# EasyEDA Pro project ProPrj_Tailtip_2026-06-10.epro, board PCB1
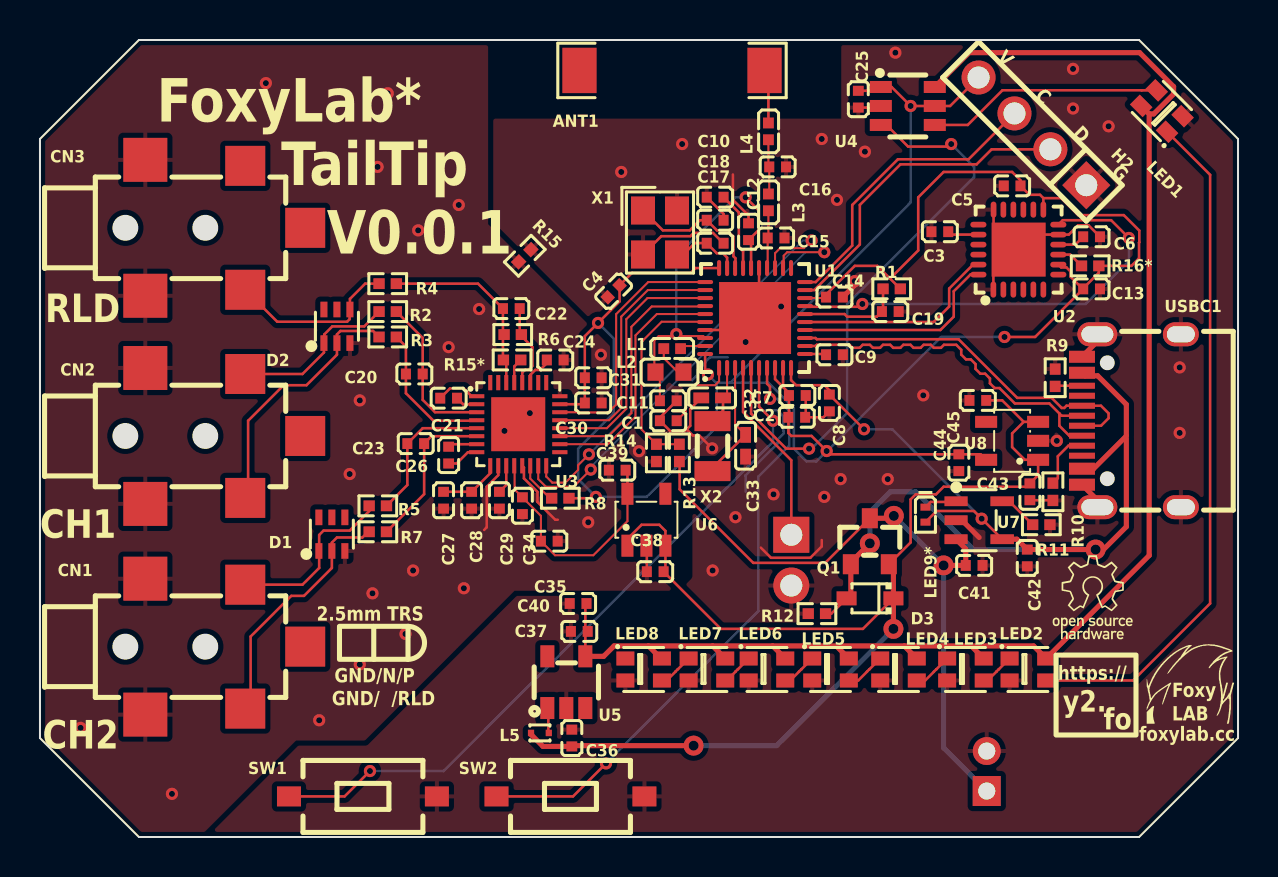
[diagram p1: board, top side]
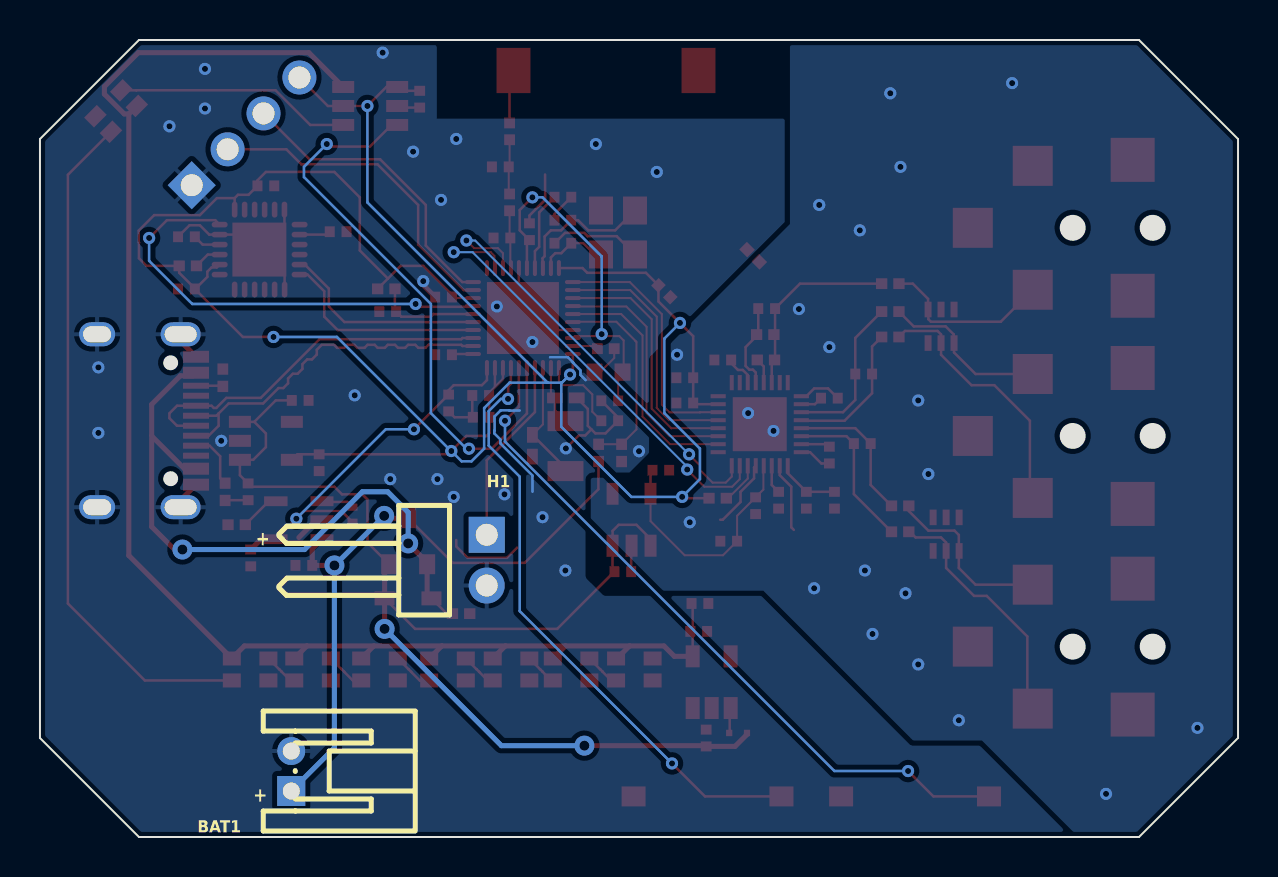
[diagram p2: board, bottom side, seen from below]

Outline 59.94 x 39.88 mm; copper layers: Top Layer, Bottom Layer. Coordinates in mm from the lower left corner of the outline.
Outline path: 0,34.92 0,4.95 4.95,0 54.99,0 59.94,4.95 59.94,34.92 54.99,39.88 4.95,39.88 0,34.92
Stack: Top Layer 0.035mm / Dielectric1 1.51mm FR4 er 4.5 / Bottom Layer 0.035mm

## Design rules (mm)
net NRF_DN: NRF_USB
net NRF_DP: NRF_USB
template: 自定义配置
spacing copperThickness1oz (default): track to track 0.102, other pairs 0.152 to 0.3
spacing copperThickness2oz: track to track 0.203, other pairs 0.152 to 0.3
spacing copperThicknessInner0.5oz: track to track 0.089, other pairs 0.152 to 0.3
track width copperThickness1oz (default): min 0.102, default 0.254, max 2.54
track width copperThickness2oz: min 0.203, default 0.254, max 2.54
track width copperThickness0.5oz: min 0.089, default 0.254, max 2.54
differential pair differentialPair (default): width min 0.127, default 0.254, max 2.54; gap min 0.152, default 0.152
via viaSize (default): diameter min 0.3, default 0.61, max 10; hole min 0.2, default 0.305, max 6.3

## Placement (name value [footprint] x y rotation side)
ANT1  AN9520-245  [ANT-SMD_L9.5-W2.1]  31.62 38.35 180 top
BAT1  S2B-PH-K-S(LF)(SN)  [CONN-TH_S2B-PH-K-S-LF-SN]  47.37 3.3 270 bottom
C1  100nF  [C0402#2]  31.44 20.83 0 top
C2  100nF  [C0402#2]  37.87 21 180 top
C3  2.2nF  [C0402#2]  45.03 30.28 180 top
C4  100nF  [C0402#2]  28.7 27.3 45 top
C5  100nF  [C0402#2]  48.64 32.58 180 top
C6  100nF  [C0402#2]  52.62 30.03 0 top
C7  4.7uF  [C0402#2]  37.89 22.09 180 top
C8  4.7uF  [C0402#2]  39.5 21.72 90 top
C9  4.7uF  [C0402#2]  39.75 24.13 180 top
C10  100pF  [C0402#2]  33.78 32.01 0 top
C11  1uF  [C0402#2]  31.44 21.83 180 top
C12  47nF  [C0402#2]  35.45 30.28 270 top
C13  100nF  [C0402#2]  52.62 27.42 0 top
C14  100nF  [C0402#2]  39.75 27.01 180 top
C15  1pF  [C0402#2]  36.83 29.97 180 top
C16  1.2pF  [C0402#2]  36.91 33.53 180 top
C17  15pF  [C0402#2]  33.78 29.71 0 top
C18  15pF  [C0402#2]  33.78 30.86 0 top
C19  100nF  [C0402#2]  42.54 26.29 180 top
C20  2.2nF  [C0402#2]  18.73 23.17 0 top
C21  1nF  [C0402#2]  20.45 21.96 0 top
C22  1.5nF  [C0402#2]  23.58 26.44 0 top
C23  2.2nF  [C0402#2]  18.8 19.68 180 top
C24  1uF  [C0402#2]  25.78 23.87 180 top
C25  100nF  [C0402#2]  40.95 36.91 90 top
C26  1nF  [C0402#2]  20.45 19.11 270 top
C27  100nF  [C0402#2]  20.19 16.85 270 top
C28  10uF  [C0402#2]  21.6 16.85 90 top
C29  1uF  [C0402#2]  22.99 16.85 270 top
C30  100nF  [C0402#2]  27.68 21.72 0 top
C31  1uF  [C0402#2]  27.68 22.98 0 top
C32  18pF  [C0402]  33.63 21.97 0 top
C33  18pF  [C0402]  35.31 19.58 90 top
C34  100nF  [C0402#2]  24.14 16.58 270 top
C35  1uF  [C0402#2]  25.48 14.8 0 top
C36  4.7uF  [C0402#2]  26.61 4.95 90 top
C37  2.2uF  [C0402#2]  26.99 10.29 0 top
C38  100nF  [C0402#2]  30.78 13.28 0 top
C39  100nF  [C0402#2]  28.88 18.35 0 top
C40  100nF  [C0402#2]  26.92 11.68 180 top
C41  4.7uF  [C0402#2]  46.74 13.59 0 top
C42  4.7uF  [C0402#2]  49.4 13.96 90 top
C43  100nF  [C0402#2]  49.53 17.27 90 top
C44  100nF  [C0402#2]  46.93 21.84 0 top
C45  100nF  [C0402#2]  45.97 18.73 90 top
CN1  PJ-209X-3B-SMT  [AUDIO-SMD_PJ-209X-3B-SMT]  9.27 9.52 0 top
CN2  PJ-209X-3B-SMT  [AUDIO-SMD_PJ-209X-3B-SMT]  9.27 20.07 0 top
CN3  PJ-209X-3B-SMT  [AUDIO-SMD_PJ-209X-3B-SMT]  9.27 30.48 0 top
D1  TPD4E1B06DCKR  [SC-70-6_L2.2-W1.3-P0.65-LS2.1-BL]  14.6 15.15 0 top
D2  TPD4E1B06DCKR  [SC-70-6_L2.2-W1.3-P0.65-LS2.1-BL]  14.86 25.55 0 top
D3  1N5819WS  [SOD-323_L1.8-W1.3-LS2.5-RD]  41.53 11.94 180 top
H1  PZ254R-11-02P  [HDR-TH_2P-P2.54-H-M-W10.4]  37.59 13.85 270 bottom
H2  PZ254V-11-04P  [HDR-TH_4P-P2.54-V-M]  49.66 35.31 135 top
L1  15nH  [L0402]  31.63 24.43 180 top
L2  10uH  [L0603]  31.5 23.26 180 top
L3  4.7nH  [L0402]  36.45 31.75 90 top
L4  2.2nH  [L0402]  36.45 35.31 90 top
L5  2.2uH  [IND-SMD_L1.0-W0.6_PLEA67BCA4R7M-1PT00]  25.01 5.21 0 top
LED1  WS2812B-2020  [LED-SMD_4P-L2.0-W2.0-TL_WS2812B-2020]  56.13 36.32 135 top
LED2  WS2812B-2020  [LED-SMD_4P-L2.0-W2.0-TL_WS2812B-2020]  49.43 8.38 0 top
LED3  WS2812B-2020  [LED-SMD_4P-L2.0-W2.0-TL_WS2812B-2020]  46.31 8.38 0 top
LED4  WS2812B-2020  [LED-SMD_4P-L2.0-W2.0-TL_WS2812B-2020]  42.96 8.38 0 top
LED5  WS2812B-2020  [LED-SMD_4P-L2.0-W2.0-TL_WS2812B-2020]  39.55 8.38 0 top
LED6  WS2812B-2020  [LED-SMD_4P-L2.0-W2.0-TL_WS2812B-2020]  36.38 8.38 0 top
LED7  WS2812B-2020  [LED-SMD_4P-L2.0-W2.0-TL_WS2812B-2020]  33.37 8.38 0 top
LED8  WS2812B-2020  [LED-SMD_4P-L2.0-W2.0-TL_WS2812B-2020]  30.21 8.38 0 top
LED9*  NCD0402G1  [LED-SMD_L1.0-W0.5_FC-F1005UGK]  44.31 16.13 270 top
Q1  AO3401A  [SOT-23_L2.9-W1.3-P1.90-LS2.4-BR]  41.52 14.8 270 top
R1  10kΩ  [R0402]  42.62 27.43 180 top
R2  47kΩ  [R0402]  17.4 26.29 0 top
R3  47kΩ  [R0402]  17.4 25.02 0 top
R4  100kΩ  [R0402]  17.4 27.69 0 top
R5  47kΩ  [R0402]  16.91 16.57 0 top
R6  1MΩ  [R0402]  23.65 25.14 0 top
R7  47kΩ  [R0402]  16.91 15.27 0 top
R8  4.7kΩ  [R0402]  26.03 16.95 180 top
R9  5.1kΩ  [R0402]  50.79 22.98 90 top
R10  5.1kΩ  [R0402]  50.68 17.27 270 top
R11  10kΩ  [R0402]  50.1 15.63 0 top
R12  100kΩ  [R0402]  38.87 11.18 180 top
R13  200kΩ  [R0402]  31.99 19.22 270 top
R14  300kΩ  [R0402]  30.84 19.22 90 top
R15  0Ω  [R0402]  24.26 29.08 225 top
R15*  100kΩ  [R0402]  23.62 23.87 0 top
R16*  10kΩ  [R0402]  52.55 28.58 0 top
SW1  TS-1101-C-W  [SW-SMD_L6.0-W3.3-LS8.0_TS-1101-C-W]  16.16 2.03 0 top
SW2  TS-1101-C-W  [SW-SMD_L6.0-W3.3-LS8.0_TS-1101-C-W]  26.54 2.03 0 top
U1  nRF52833-QDAA-R  [QFN-40_L5.0-W5.0-P0.40-TL-EP3.6]  35.78 25.97 90 top
U2  MPU-6050  [QFN-24_L4.0-W4.0-P0.50-BL-EP2.7]  48.95 29.39 0 top
U3  ADS1292IRSMR  [QFN-32_L4.0-W4.0-P0.40-TL-EP2.7]  23.93 20.65 0 top
U4  SN74LVC1T45DBVR  [SOT-23-6_L2.9-W1.6-P0.95-LS2.8-BR]  43.42 36.58 180 top
U5  TPS613222ADBVR  [TSOT-23-5_L2.9-W1.6-P0.95-LS2.8-BR]  26.34 7.75 270 top
U6  TLV70233DBVR  [SOT-23-5_L3.0-W1.7-P0.95-LS2.8-BR]  30.34 15.87 270 top
U7  MCP73831T-2ACI/OT  [SOT-23-5_L3.0-W1.7-P0.95-LS2.8-BL]  46.99 15.85 270 top
U8  TLV70233DBVR  [SOT-23-5_L3.0-W1.7-P0.95-LS2.8-BR]  48.64 19.82 0 top
USBC1  TYPE-C-31-M-12  [USB-C_SMD-TYPE-C-31-M-12_1]  54.61 20.83 90 top
X1  32MHz  [CRYSTAL-SMD_4P-L3.2-W2.5-BL]  31.02 30.25 270 top
X2  32.768kHz  [FC-135R_L3.2-W1.5]  33.65 19.56 270 top

## Footprints (pads in the part's own frame, mm; a bottom-side part is the same pattern mirrored in y, then rotated)
ANT-SMD_L9.5-W2.1
  rect 1.71x2.268 smd: 1(-4.63,0) 2(4.63,0)
AUDIO-SMD_PJ-209X-3B-SMT
  rect 2.2x2.2 smd: 1(-4,3.4) 1(-4,-3.4)
  rect 2x2 smd: 2(1,-3.1) 3(1,3.1) 10(4,0)
C0402
  rect 0.79x0.54 smd: 1(-0.545,0) 2(0.545,0)
C0402#2
  rect 0.5x0.54 smd: 1(-0.42,0) 2(0.42,0)
CONN-TH_S2B-PH-K-S-LF-SN
  rect 1.5x1.4 hole 0.85: 1(1,0)
  round 1.4 hole 0.85: 2(-1,0)
CRYSTAL-SMD_4P-L3.2-W2.5-BL
  rect 1.4x1.2 smd: 1(-1.1,-0.85) 2(1.1,-0.85) 3(1.1,0.85) 4(-1.1,0.85)
FC-135R_L3.2-W1.5
  rect 1x1.8 smd: 1(-1.25,0) 2(1.25,0)
HDR-TH_2P-P2.54-H-M-W10.4
  rect 1.8x1.8 hole 1.1: 1(-1.27,0)
  round 1.8 hole 1.1: 2(1.27,0)
HDR-TH_4P-P2.54-V-M
  rect 1.7x1.7 hole 1.1: 1(-3.81,0)
  round 1.7 hole 1.1: 2(-1.27,0) 3(1.27,0) 4(3.81,0)
IND-SMD_L1.0-W0.6_PLEA67BCA4R7M-1PT00
  rect 0.31x0.32 smd: 1(-0.445,0) 2(0.445,0)
L0402
  rect 0.54x0.54 smd: 1(-0.42,0) 2(0.42,0)
L0603
  rect 0.8x0.864 smd: 1(-0.7,0) 2(0.7,0)
LED-SMD_4P-L2.0-W2.0-TL_WS2812B-2020
  rect 0.9x0.7 smd: 1(-0.915,0.55) 2(-0.915,-0.55) 3(0.915,-0.55) 4(0.915,0.55)
LED-SMD_L1.0-W0.5_FC-F1005UGK
  rect 0.35x0.5 smd: 1(-0.375,0) 2(0.375,0)
QFN-24_L4.0-W4.0-P0.50-BL-EP2.7
  oval 0.28x0.8 smd: 1(-1.25,-2) 2(-0.75,-2) 3(-0.25,-2) 4(0.25,-2) 5(0.75,-2) 6(1.25,-2) 13(1.25,2) 14(0.75,2) 15(0.25,2) 16(-0.25,2) 17(-0.75,2) 18(-1.242,2)
  oval 0.8x0.28 smd: 7(2,-1.25) 8(2,-0.75) 9(2,-0.25) 10(2,0.25) 11(2,0.75) 12(2,1.25) 19(-2,1.25) 20(-2,0.75) 21(-2,0.25) 22(-2,-0.25) 23(-2,-0.75) 24(-2,-1.25)
  rect 2.7x2.7 smd: 25(0.013,0)
QFN-32_L4.0-W4.0-P0.40-TL-EP2.7
  rect 0.76x0.2 smd: 1(-2.08,1.4) 2(-2.08,1) 3(-2.08,0.6) 4(-2.08,0.2) 5(-2.08,-0.2) 6(-2.08,-0.6) 7(-2.08,-1) 8(-2.08,-1.4) 17(2.08,-1.4) 18(2.08,-1) 19(2.08,-0.6) 20(2.08,-0.2) 21(2.08,0.2) 22(2.08,0.6) 23(2.08,1) 24(2.08,1.4)
  rect 0.2x0.76 smd: 9(-1.4,-2.08) 10(-1,-2.08) 11(-0.6,-2.08) 12(-0.2,-2.08) 13(0.2,-2.08) 14(0.6,-2.08) 15(1,-2.08) 16(1.4,-2.08) 25(1.4,2.08) 26(1,2.08) 27(0.6,2.08) 28(0.2,2.08) 29(-0.2,2.08) 30(-0.6,2.08) 31(-1,2.08) 32(-1.4,2.08)
  rect 2.7x2.7 smd: 33(0,0)
QFN-40_L5.0-W5.0-P0.40-TL-EP3.6
  oval 0.8x0.2 smd: 1(-2.499,1.8) 2(-2.499,1.4) 3(-2.499,1) 4(-2.499,0.6) 5(-2.499,0.2) 6(-2.499,-0.2) 7(-2.499,-0.6) 8(-2.499,-1) 9(-2.499,-1.4) 10(-2.499,-1.8) 21(2.499,-1.8) 22(2.499,-1.4) 23(2.499,-1) 24(2.499,-0.6) 25(2.499,-0.2) 26(2.499,0.2) 27(2.499,0.6) 28(2.499,1) 29(2.499,1.4) 30(2.499,1.8)
  oval 0.2x0.8 smd: 11(-1.8,-2.499) 12(-1.4,-2.499) 13(-1,-2.499) 14(-0.6,-2.499) 15(-0.2,-2.499) 16(0.2,-2.499) 17(0.6,-2.499) 18(1,-2.499) 19(1.4,-2.499) 20(1.8,-2.499) 31(1.8,2.499) 32(1.4,2.499) 33(1,2.499) 34(0.6,2.499) 35(0.2,2.499) 36(-0.2,2.499) 37(-0.6,2.499) 38(-1,2.499) 39(-1.4,2.499) 40(-1.8,2.499)
  rect 3.6x3.6 smd: 41(0,0)
R0402
  rect 0.566x0.54 smd: 1(-0.433,0) 2(0.433,0)
SC-70-6_L2.2-W1.3-P0.65-LS2.1-BL
  rect 0.35x0.78 smd: 1(-0.65,-0.84) 2(0,-0.84) 3(0.65,-0.84) 4(0.65,0.84) 5(0,0.84) 6(-0.65,0.84)
SOD-323_L1.8-W1.3-LS2.5-RD
  rect 1x0.7 smd: 1(-1.173,0) 2(1.173,0)
SOT-23-5_L3.0-W1.7-P0.95-LS2.8-BL
  rect 0.49x1.157 smd: 1(-0.95,-1.153) 2(0,-1.153) 3(0.95,-1.153)
  rect 0.49x1.175 smd: 4(0.95,1.153) 5(-0.95,1.153)
SOT-23-5_L3.0-W1.7-P0.95-LS2.8-BR
  rect 1.1x0.6 smd: 1(1.3,-0.95) 2(1.3,0) 3(1.3,0.95) 4(-1.3,0.95) 5(-1.3,-0.95)
SOT-23-6_L2.9-W1.6-P0.95-LS2.8-BR
  rect 1.1x0.6 smd: 1(1.35,-0.95) 2(1.35,0) 3(1.35,0.95) 4(-1.35,0.95) 5(-1.35,0) 6(-1.35,-0.95)
SOT-23_L2.9-W1.3-P1.90-LS2.4-BR
  rect 1x0.8 smd: 1(1.15,-0.95) 2(1.15,0.95) 3(-1.15,0)
SW-SMD_L6.0-W3.3-LS8.0_TS-1101-C-W
  rect 1.2x1 smd: 1(-3.7,0) 2(3.7,0)
TSOT-23-5_L2.9-W1.6-P0.95-LS2.8-BR
  rect 1.1x0.7 smd: 1(1.294,-0.951) 2(1.294,-0.001) 3(1.294,0.951) 4(-1.294,0.951) 5(-1.294,-0.949)
USB-C_SMD-TYPE-C-31-M-12_1
  oval 1.2x2 hole 0.8x1.6: 1(4.325,1.706) 4(-4.325,1.706)
  oval 1.2x1.8 hole 0.8x1.4: 2(4.325,-2.474) 3(-4.325,-2.474)
  custom 0.6x1.3 smd: A1B12(-3.2,2.474) A4B9(-2.4,2.474) B1A12(3.2,2.474) B4A9(2.401,2.474)
  rect 0.3x1.3 smd: A5(-1.25,2.474) A6(-0.25,2.474) A7(0.25,2.474) A8(1.25,2.474) B5(1.75,2.474) B6(0.75,2.474) B7(-0.75,2.474) B8(-1.75,2.474)

## Nets
As in the schematic, except:
3V3: C2.2 C4.2 C5.1 C7.2 C13.1 C14.2 C25.2 C30.1 C31.1 C45.2 H2.4 R1.1 R8.1 R16*.2 U1.8 U1.9 U1.18 U1.30 U1.40 U2.8 U2.13 U3.23 U4.1 U4.5 U8.5
VBUS: C8.2 C42.2 D3.2 LED9*.2 Q1.1 R12.1 U1.10 U7.4 USBC1.A4B9 USBC1.B4A9
$1N2506: LED9*.1 U7.1
$1N5837: R16*.1 U2.9
$1N8365: R15*.2 U3.29
$1N8369: C22.1 R4.2 R6.1 R15*.1 U3.30

Pads without a net: ANT1 2; CN1 10; CN2 10; CN3 3 10; D1 4 5 6; D2 5 6; LED8 1; U1 21; U2 2 3 4 5 6 7 14 15 16 17 19 21 22; U3 17 25 26 31 32; U5 3 5; U6 4; U8 4; USBC1 A8 B8

## Via types
v1: diameter 1, hole 0.5, Top Layer to Bottom Layer, 6 vias
v2: diameter 0.61, hole 0.305, Top Layer to Bottom Layer, 67 vias

## Routing (per net, layer and track width the routed paths; a pad name or vN(x,y) marks a point on that pad's centre or on a via; arc(x,y) is an arc through that point)
3V3: length 131.5
  Top Layer w0.102: 39.33,26.97 U1.18
  Top Layer w0.127: U1.30 32.8,28.47 32.56,28.23 29.63,28.23 29,27.6 29,26.8 v2(27.92,25.72) 27.26,25.06 27.26,21.72 27.2,21.65 U3.23 ; C13.1 49.79,25.02 v2(48.26,25.02) ; 50.2,31.97 51.09,31.97 51.94,31.11 54.23,31.11 55,30.34 55,29.76 54.99,29.74 54.99,28.96 54.61,28.58 R16*.2 52.98,28.23 52.17,27.42 51.57,28.02 51.57,28.29 51.36,28.5 51.1,28.5 U2.8 ; 50.2,31.97 U2.13 ; 50.2,31.97 50.04,32.13 49.51,32.13 C5.1 49.06,32.85 48.64,33.27 45.21,33.27 43.94,32 43.94,29.35 42.53,27.94 ; 37.18,22.51 36.78,22.91 U1.8 ; 37.18,22.51 37.47,22.22 C7.2 37.47,21.03 C2.2 37.45,20.21 37.59,20.07 38.61,20.07 39.53,19.15 C45.2 47.06,19.15 U8.5 ; 37.18,22.51 U1.9 ; U1.40 33.28,23.28 v2(33.42,23.14) ; R8.1 27.75,16.95 v2(27.81,17.02) ; C25.2 41.88,37.34 U4.1 42.61,37.53 v2(43.56,36.58) U4.5 45.54,36.58 46.96,38 ; 42.53,27.94 R1.1 ; 42.53,27.94 41.9,28.57 40.77,28.57 39.33,27.14 C14.2
  Bottom Layer w0.127: 34.54,22.73 36.45,22.73 37.72,21.46 37.72,19.43 38.35,18.8 38.84,18.8 v2(39.36,19.31) ; 34.54,22.73 43.56,31.75 v2(43.56,36.58) ; 34.54,22.73 33.86,22.73 ; v2(33.42,23.14) 33.83,22.73 33.86,22.73 ; 33.86,22.73 33.86,20.53 30.35,17.02 v2(27.81,17.02) 26.92,17.91 26.92,19.43 28.7,21.21 28.7,24.94 v2(27.92,25.72) ; 39.37,19.3 45.09,25.02 v2(48.26,25.02)
3V3A: length 12.2
  Top Layer w0.102: U6.5 29.39,15.8 27.69,14.1 25.77,14.1 C35.1 25.06,16.07 C34.1 23.75,17.39 23.75,18.56 23.73,18.57
  Top Layer w0.127: C39.2 29.39,18.26 U6.5
5V0: length 76.9
  Top Layer w0.127: U5.4 27.29,11.63 C40.1
  Top Layer w0.254: LED7.4 33.66,9.56 ; 33.66,9.56 30.44,9.56 ; 33.66,9.56 36.66,9.56 ; 46.59,9.56 49.72,9.56 LED2.4 55.5,14.09 55.5,36.18 ; 46.59,9.56 LED3.4 ; 46.59,9.56 43.24,9.56 ; 30.44,9.56 31.07,8.93 LED8.4 ; 30.44,9.56 28.72,9.56 28.2,9.04 U5.4 ; 43.24,9.56 39.84,9.56 ; 43.24,9.56 43.87,8.93 ; 39.84,9.56 40.47,8.93 ; 39.84,9.56 36.66,9.56 ; 55.5,36.18 55.73,36.18 56.72,37.17 56.72,37.54 55.02,39.24 46.49,39.24 U4.6 ; 55.5,36.18 LED1.4 ; 36.66,9.56 LED6.4
AGND: length 8.3
  Top Layer w0.127: U6.2 30.36,14.56 C38.1 ; U3.10 22.93,18.1 22.35,17.53 22.35,15.49 22.22,15.37 ; U3.13 24.22,18.49 24.22,17.94 24.89,17.27 24.89,16.76 25.78,15.87 25.91,15.87
  vias: v2(2.03,5.46) v2(6.6,2.16) v2(11.3,37.72) v2(13.97,5.84) v2(15.49,18.16) v2(16,21.84) v2(16,8.64) v2(16.64,12.19) v2(16.89,33.53) v2(17.4,37.21) v2(18.29,10.16) v2(18.67,13.33) v2(18.92,30.35) v2(20.45,24.51) v2(20.96,31.62) v2(21.21,12.45) v2(21.97,26.42) v2(23.24,20.32) v2(24.51,21.21) v2(27.43,15.75) v2(28.07,24.13)
GND: length 53.4
  Top Layer w0.127: C8.1 39.2,21 38.29,21 38.31,21.03 38.31,22.09 ; C43.1 50.67,16.85 R10.2 ; X1.2 31.09,30.06 32.54,30.06 32.71,30.23 33.67,30.23 34.19,29.71 C17.2 ; 32.35,20.39 32.53,20.57 32.53,21.42 C32.1 ; 32.35,20.39 32.15,20.19 31.65,20.19 C1.1 31.02,20.99 C11.1 ; 32.35,20.39 32.37,20.39 32.66,20.09 32.98,20.09 v2(33.63,19.44) ; C6.2 52.46,30.61 51.94,30.61 51.48,30.14 U2.11 50.03,30.14 50.03,29.52 49.9,29.39 U2.25 ; U2.25 47.71,30.64 U2.18 ; U2.25 47.7,28.13 U2.1 ; 36.07,14.48 36.58,13.97 38.54,13.97 39.12,14.54 39.12,14.86 ; U1.25 35.98,26.17 U1.41 35.18,25.37 U1.37 ; U4.2 41.99,36.49 C25.1 ; C10.1 34.2,31.17 C18.2 ; 34.67,33.15 34.67,31.88 35.45,31.1 C12.1
  Top Layer w0.254: U7.2 46.13,15.85 46.99,14.99 ; v2(40.77,27.81) 40.77,27.61 C14.1 ; USBC1.A1B12 52.9,16.86 USBC1.4 ; USBC1.B1A12 52.9,24.8 USBC1.1
  Bottom Layer w0.127: 35.31,17.27 35.31,18.09 36.91,19.69 36.91,19.89 37.21,20.19 37.21,20.32 37.2,20.33 37.2,21.04 36.89,21.35 36.46,21.35 36.45,21.34 35.94,21.34 ; 32.64,22.86 32.9,23.12 32.9,23.35 33.27,23.73 33.27,23.75 33.53,24 34.42,24
  vias: v2(29.08,33.27) v2(29.97,19.3) v2(32.13,34.67) v2(33.66,13.33) v2(34.8,16) v2(35.31,24.76) v2(36.7,17.14) v2(37.08,26.54) v2(39.12,34.92) v2(39.24,17.02) v2(39.88,31.88) v2(40.06,17.91) v2(41.28,34.29) v2(42.42,17.91) v2(42.8,39.24) v2(44.2,22.1) v2(50.88,19.82) v2(51.69,38.43) v2(51.69,36.45) v2(53.47,35.56) v2(57.02,23.49) v2(57.02,20.22)
VBAT: length 32.9
  Top Layer w0.127: R13.2 32,18.77 32,17.4 35.69,13.72 39.29,13.72 Q1.3
  Top Layer w0.254: U7.3 46.32,14.42 46.32,13.59 v1(45.21,13.59) ; v1(42.72,16.07) 42.6,15.95 Q1.3
  Bottom Layer w0.254: v1(42.72,16.07) 45.2,13.59 v1(45.21,13.59) 45.21,4.46 BAT1.1
VBUS: length 55.5
  Top Layer w0.127: D3.2 39.59,11.18 R12.1 ; v2(41.23,20.4) C8.2 39.5,22.35 39.24,22.61 37.83,22.61 37.58,22.86 U1.10 ; U7.4 v2(47.12,15.93) 46.73,16.31 44.86,16.31 LED9*.2
  Top Layer w0.254: v1(41.52,14.69) 40.57,13.74 Q1.1 40.57,12.16 D3.2 ; USBC1.B4A9 52.29,23.08 52.92,23.08 54.36,21.64 54.36,20.07 52.72,18.43 USBC1.A4B9 ; U7.4 48.88,14.9 49.4,14.38 53.21,14.38 54.36,15.53 54.36,19.94
  Bottom Layer w0.127: v2(41.23,20.4) 42.64,20.4 v2(47.12,15.93)
  Bottom Layer w0.254: v1(41.52,14.69) 41.52,16.25 42.54,17.27 43.81,17.27 46.7,14.38 v1(52.82,14.38)
1N: length 8.5
  Top Layer w0.127: R2.1 16.23,25.55 14.63,25.55 14.22,25.15 14.22,24.73 D2.1 14.21,24.24 13.13,23.17 CN2.3
1P: length 13.1
  Top Layer w0.127: CN2.2 10.41,17.11 10.41,20.83 12.19,22.61 13.34,22.61 14.86,24.13 D2.2 14.86,25.15 15.03,25.32 16.67,25.32 R3.1
2N: length 9
  Top Layer w0.127: R5.1 16.47,16.31 15.49,15.33 14.19,15.33 13.97,15.11 13.97,14.33 13.96,14.31 13.97,14.3 13.97,13.46 13.13,12.62 CN1.3
2P: length 12.6
  Top Layer w0.127: R7.1 16.41,15.27 16.13,14.99 14.86,14.99 14.6,14.73 D1.2 14.6,13.46 13.21,12.06 12.57,12.06 10.54,10.03 10.54,6.69 CN1.2
ADS_CS: length 12.3
  Top Layer w0.102: U3.18 28.42,19.65 29.79,21.03 29.79,25.1 30.87,26.17 U1.35
ADS_DRDY: length 12.6
  Top Layer w0.102: U3.22 26.92,21.25 26.93,21.24 28.44,21.24 28.83,21.64 28.83,26.16 30.43,27.77 U1.31
ADS_MISO: length 12.6
  Top Layer w0.102: U1.32 30.41,27.37 29.08,26.03 29.08,21.46 28.47,20.85 U3.21
ADS_MOSI: length 12.5
  Top Layer w0.102: U3.19 28.44,20.05 29.59,21.21 29.59,25.53 30.61,26.54 33.26,26.54 U1.34
ADS_RST: length 22.8
  Top Layer w0.102: U1.22 37.21,28.5 37.21,29.08 37.39,29.26 v2(39.24,29.26) ; U3.15 24.93,17.91 25.31,17.53 26.7,17.53 v2(27.56,18.38)
  Bottom Layer w0.102: v2(27.56,18.38) 27.56,18.52 38.3,29.26 v2(39.24,29.26)
ADS_SCLK: length 12.6
  Top Layer w0.102: U3.20 28.36,20.45 29.34,21.43 29.34,25.91 30.4,26.97 U1.33
ADS_START: length 21.9
  Top Layer w0.102: U3.16 25.33,18.03 25.63,17.73 26.29,17.73 26.92,18.36 26.92,18.6 v2(27.47,19.15) ; v2(38.61,29.84) 38.23,29.46 37.03,29.46 36.78,29.21 U1.23
  Bottom Layer w0.102: v2(38.61,29.84) 38.17,29.84 v2(27.47,19.15)
AIN2: length 9.3
  Top Layer w0.127: H1.1 37.59,18.85 35.18,21.26 U1.4
BAT_ADC: length 10.2
  Top Layer w0.102: R13.1 R14.2 30.1,20.4 30.1,24.76 30.15,24.81 30.15,24.82 31.11,25.78 33.27,25.78 U1.36
DEC46: length 18.4
  Top Layer w0.102: U1.38 33.18,25.06 30.96,25.06 30.74,24.84 30.74,23.32 L2.2 31.02,23.04 C11.2
  Top Layer w0.127: U1.26 35.58,29.74 C12.2 35.94,30.35 35.94,31.37 v2(35.31,32)
  Bottom Layer w0.127: v2(35.31,32) 34.8,32 31.84,29.05 v2(31.84,25.16)
MPU_CLK: length 10.4
  Top Layer w0.127: U2.23 46.69,28.64 45.49,27.44 45.49,26.54 44.71,25.77 U1.15
MPU_INT: length 22.3
  Top Layer w0.127: U1.17 38.31,26.53 41.01,26.53 v2(41.15,26.67) ; U2.12 51.17,30.86 53.59,30.86 v2(54.48,29.97)
  Bottom Layer w0.127: v2(41.15,26.67) 52.32,26.67 54.48,28.83 v2(54.48,29.97)
MPU_SDA: length 10.6
  Top Layer w0.127: U2.24 46.56,28.14 45.72,27.3 45.72,26.03 45.05,25.37 U1.14
NRF_CLK: length 15.2
  Top Layer w0.127: 48.76,36.2 46.46,33.91 42.93,33.91 40.64,31.62 40.64,29.59 38.81,27.77 U1.20
NRF_DIO: length 16.3
  Top Layer w0.127: H2.2 47.62,34.41 46.86,33.65 43.05,33.65 41.02,31.62 41.02,29.65 38.74,27.37 U1.19
NRF_DN: length 18.3
  Top Layer w0.127: USBC1.B7 51.5,20.08 51.01,20.57 51.01,21.19 ; USBC1.A7 51.12,21.08 51.01,21.19 ; 51.01,21.19 50.5,21.69 48.78,21.69 48.01,22.46 47.77,22.46 47.53,22.7 47.53,22.94 47.29,23.18 47.05,23.18 46.81,23.42 46.81,23.66 46.57,23.9 46.33,23.9 46.09,24.14 46.09,24.38 45.84,24.63 45.23,24.63 45.08,24.48 44.72,24.48 44.57,24.63 44.21,24.63 44.06,24.48 43.71,24.48 43.56,24.63 43.2,24.63 43.05,24.48 42.69,24.48 42.54,24.63 42.18,24.63 42.03,24.48 41.67,24.48 41.52,24.63 41.17,24.63 41.02,24.48 40.66,24.48 40.51,24.63 38.87,24.63 38.81,24.57 U1.12
NRF_DP: length 18.6
  Top Layer w0.127: U1.13 38.81,24.97 38.87,24.91 45.96,24.91 48.9,21.97 50.62,21.97 51.12,21.47 51.25,21.47 51.36,21.58 USBC1.B6 53.09,21.58 53.47,21.2 53.47,20.95 53.09,20.58 USBC1.A6
NRF_RST: length 5.2
  Top Layer w0.127: U1.16 40.25,26.17 40.39,26.03 41.87,26.03 C19.2 42.18,26.35 R1.2
NRF_XC1: length 7.1
  Top Layer w0.127: U1.28 34.8,28.48 34.8,28.96 34.69,29.06 34.69,30.04 34.38,30.35 33.87,30.35 C18.1 33.02,30.86 32.51,30.35 31.17,30.35 X1.1
NRF_XC2: length 3.6
  Top Layer w0.127: U1.29 34.38,28.99 34.16,29.21 33.86,29.21 C17.1 33.35,29.72 32.77,29.72 32.19,29.15 X1.3
NRF_XL1: length 3
  Top Layer w0.102: C32.2 34.38,22.17 U1.2
  Top Layer w0.127: X2.1 34.18,21.33 C32.2
NRF_XL2: length 6.1
  Top Layer w0.102: U1.3 34.78,20.65 C33.2
  Top Layer w0.127: 33.65,18.34 33.65,18.18 ; C33.2 33.65,18.47
RGBD: length 29.1
  Top Layer w0.127: v2(45.59,34.67) 45.47,34.54 43.43,34.54 42.35,35.63 U4.3 ; U1.5 35.58,21.19 37.34,19.43 v2(38.48,19.43)
  Bottom Layer w0.127: v2(38.48,19.43) 38.61,19.43 40.39,21.21 40.39,26.67 46.74,33.02 46.74,33.53 v2(45.59,34.67)
RLD: length 8.7
  Top Layer w0.127: CN3.2 11.87,25.78 15.37,25.78 15.49,25.91 15.49,26.38 D2.4 15.51,26.92 16.27,27.69 R4.1
SW1: length 35.5
  Top Layer w0.127: v2(36.68,20.83) 35.98,21.53 U1.6 ; SW1.1 15.24,2.03 v2(16.51,3.3)
  Bottom Layer w0.127: v2(16.51,3.3) 20.19,3.3 36.68,19.79 v2(36.68,20.83)
SW2: length 30.4
  Top Layer w0.127: v2(36.53,21.92) 36.53,22.53 36.38,22.68 U1.7 ; v2(28.32,3.68) 26.67,2.03 SW2.1
  Bottom Layer w0.127: v2(28.32,3.68) 35.94,11.3 35.94,18.03 37.49,19.58 37.49,21.31 36.88,21.92 v2(36.53,21.92)
VSYS: length 59.7
  Top Layer w0.127: D3.1 41.18,10.41 34.07,10.41 C38.2 31.29,13.37 U6.3 31.29,15.31 30.99,15.62 30.1,15.62 29.39,14.92 U6.1 ; 49.22,20.77 48.64,20.19 48.64,19.51 49.28,18.87 U8.1 49.94,18.1 C43.2 49.36,17.53 45.21,17.53 44.83,17.14 43.81,17.14 43.56,16.89 43.56,14.74 Q1.2 ; 49.22,20.77 U8.3 ; 49.22,20.77 48.15,21.84 C44.2
  Top Layer w0.254: 24.59,5.2 24.59,5.11 25.17,4.53 C36.1 26.65,4.57 32.38,4.57 ; Q1.2 42.7,13.42 D3.1 v1(42.7,10.41)
  Bottom Layer w0.254: 32.38,4.57 36.86,4.57 v1(42.7,10.41)
  vias: v1(32.7,4.57)
$1N1691: length 1.4
  Top Layer w0.127: R9.1 50.83,22.58 USBC1.B5
$1N1802: length 2.9
  Top Layer w0.127: USBC1.A5 51.46,19.58 50.93,19.05 50.93,17.95 R10.1
$1N2283: length 2
  Top Layer w0.127: U7.5 48.5,16.8 R11.1
$1N2506: length 1.7
  Top Layer w0.127: LED9*.1 44.57,16.76 45.8,16.76 U7.1
$1N5375: length 1.4
  Top Layer w0.127: C6.1 51.8,29.64 U2.10
$1N5633: length 1.6
  Top Layer w0.127: C3.1 45.59,30.14 U2.20
$1N5837: length 1.4
  Top Layer w0.127: R16*.1 51.55,29.14 U2.9
$1N7464: length 7.1
  Top Layer w0.127: U3.4 21.82,20.83 19.69,20.83 18.31,22.2 C20.1 18.31,24.54 R3.2
$1N7470: length 7.3
  Top Layer w0.127: R5.2 18.38,17.61 C23.2 19.15,20.45 U3.5
$1N7476: length 8
  Top Layer w0.127: R7.2 19.22,17.16 C23.1 19.59,20.05 U3.6
$1N7484: length 7.9
  Top Layer w0.127: U3.3 19.77,21.25 19.15,21.87 C20.2 19.15,24.97 R2.2
$1N7560: length 1.1
  Top Layer w0.127: C21.2 21.17,21.65 U3.2
$1N7564: length 2.2
  Top Layer w0.127: C21.1 20.51,22.44 21.21,22.44 21.6,22.05 U3.1
$1N7602: length 1.6
  Top Layer w0.127: C26.2 20.85,18.69 21.41,19.25 U3.8
$1N7604: length 1.5
  Top Layer w0.127: U3.7 20.57,19.65 C26.1
$1N7711: length 3.1
  Top Layer w0.127: C27.1 C28.2 22.53,18.2 U3.9
$1N7829: length 1.4
  Top Layer w0.127: C29.1 23.33,17.61 U3.11
$1N8214: length 2
  Top Layer w0.102: 25.53,16.94 24.53,17.93 U3.14
$1N8365: length 1.3
  Top Layer w0.127: 23.73,22.73 23.73,23.54 R15*.2
$1N8369: length 9.6
  Top Layer w0.127: R4.2 21.92,27.69 C22.1 23.16,23.89 23.19,23.87 23.33,23.73 U3.30
$1N8536: length 4.3
  Top Layer w0.127: C22.2 24,25.22 R6.2 24.09,25.06 24.64,24.51 24.64,23.57 24.45,23.38 24.27,23.38 24.13,23.24 U3.28
$1N8581: length 1.6
  Top Layer w0.127: U3.27 24.53,23.12 24.78,23.37 25.02,23.37 25.36,23.71 25.36,23.87
$1N11224: length 11.8
  Top Layer w0.127: LED1.3 55.12,37.36 55.12,37.36 48.16,37.36 46.42,35.63 U4.4
$1N12511: length 34.3
  Top Layer w0.127: LED2.3 54.69,7.83 58.55,11.68 58.55,33.13 LED1.1
$1N12520: length 2
  Top Layer w0.127: 43.87,7.83 44.29,7.83 44.72,8.27 44.72,8.27 44.85,8.4 44.86,8.4 LED3.1
$1N12528: length 1.8
  Top Layer w0.127: LED3.3 47.41,7.83 47.85,8.27 47.85,8.27 47.98,8.4 47.98,8.4 LED2.1
$1N12539: length 2
  Top Layer w0.127: LED4.1 41.51,8.4 41.5,8.4 41.38,8.27 41.38,8.27 40.94,7.83 40.47,7.83
$1N12548: length 1.8
  Top Layer w0.127: LED5.1 38.1,8.4 38.1,8.4 37.97,8.27 37.97,8.27 37.54,7.83 LED6.3
$1N12557: length 1.6
  Top Layer w0.127: LED7.3 34.36,7.83 34.79,8.27 34.79,8.27 34.92,8.4 34.93,8.4 LED6.1
$1N12578: length 1.8
  Top Layer w0.127: LED8.3 31.36,7.83 31.79,8.27 31.79,8.27 31.92,8.4 31.92,8.4 LED7.1
$1N13468: length 4.1
  Top Layer w0.102: C1.2 32.31,21.28 32.31,22.15 32.77,22.61 33.78,22.61 33.98,22.8 U1.1
$1N13753: length 1.1
  Top Layer w0.127: U1.11 39.29,24.17 C9.2
$1N13955: length 2.9
  Top Layer w0.102: U1.24 36.41,28.5 36.41,29.97 36.45,30.01 L3.1
$1N14068: length 2.7
  Top Layer w0.102: L4.1 36.45,33.57 36.49,33.53 36.49,32.22 L3.2
$1N14239: length 2.7
  Top Layer w0.127: L4.2 36.45,38.17 36.26,38.35
$1N14478: length 4
  Top Layer w0.127: U1.27 35.18,29.31 34.97,29.53 34.97,31.25 C10.2
$1N14742: length 1.3
  Top Layer w0.102: U1.39 32.18,24.57 L1.1
$1N14746: length 1.7
  Top Layer w0.102: L1.2 31.21,23.96 31.92,23.26 L2.1
$1N15463: length 1.3
  Top Layer w0.127: 25.38,6.45 25.43,6.4 25.43,5.2

## Copper pours and planes (outline as drawn; the poured copper is in the pictures)
AGND on Top Layer: 0,34.92 4.95,39.88 22.42,39.88 22.42,30.66 29.21,23.88 29.21,19.11 30.34,17.97 32.32,17.97 32.38,17.91 32.38,13.08 31.62,12.32 23.75,12.32 16.26,4.83 12.81,4.83 7.99,0 5.08,0 4.95,-0.13 0,4.83
AGND on Bottom Layer: 0,34.92 4.95,39.88 22.42,39.88 22.42,30.66 29.21,23.88 29.21,19.11 30.34,17.97 32.32,17.97 32.38,17.91 32.38,13.08 31.62,12.32 23.75,12.32 16.26,4.83 12.81,4.83 7.99,0 5.08,0 4.95,-0.13 0,4.83
GND on Top Layer: 40.09,39.88 40.09,35.94 22.57,35.94 22.57,30.73 29.42,23.89 29.42,19.18 30.32,18.27 30.34,18.27 30.48,18.13 30.48,18.11 32.44,18.11 32.51,18.03 32.51,13.08 31.62,12.19 23.81,12.19 16.32,4.7 12.95,4.7 8.26,0 54.99,0 59.94,4.95 59.94,34.92 54.99,39.88
GND on Bottom Layer: 40.09,39.88 40.09,35.94 22.57,35.94 22.57,30.73 29.42,23.89 29.42,19.18 30.32,18.27 30.34,18.27 30.48,18.13 30.48,18.11 32.44,18.11 32.51,18.03 32.51,13.08 31.62,12.19 23.81,12.19 16.32,4.7 12.95,4.7 8.26,0 54.99,0 59.94,4.95 59.94,34.92 54.99,39.88

## Text on the board
Bottom Silkscreen Layer: +
Top Silkscreen Layer: 2.5mm TRS | GND/  /RLD | GND/N/P | https:// | foxylab.cc | Foxy // / LAB | V       C       D       G | y2. | fo | CH1 | CH2 | RLD | FoxyLab* | TailTip | V0.0.1
